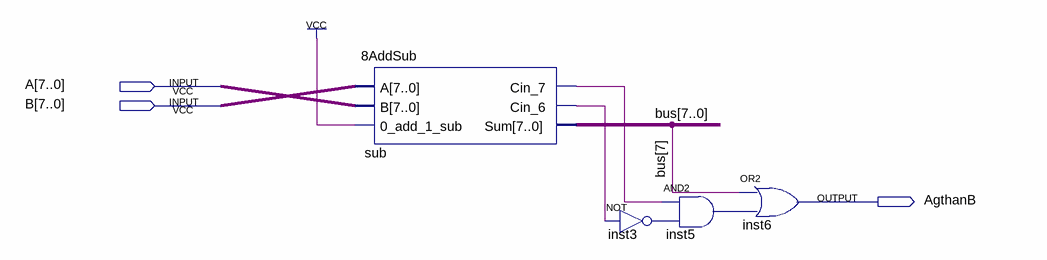
[diagram p0: schematic sheet]
// Quartus schematic 8gthan.bdf as structural Verilog: 4 symbols, 3 pins
module \8gthan  (
  input  [7:0] A,
  input  [7:0] B,
  output AgthanB
);

  wire inst3_out, inst5_out, sub_cin_6, sub_cin_7;
  wire [7:0] bus;

  \8AddSub  sub (.A(B), .B(A), .\0_add_1_sub (1'b1), .Cin_7(sub_cin_7), .Cin_6(sub_cin_6), .Sum(bus));
  not inst3 (inst3_out, sub_cin_6);
  and inst5 (inst5_out, sub_cin_7, inst3_out);
  or inst6 (AgthanB, bus[7], inst5_out);
endmodule
